# EAGLE design modulo_potencia (EAGLE 5.08)
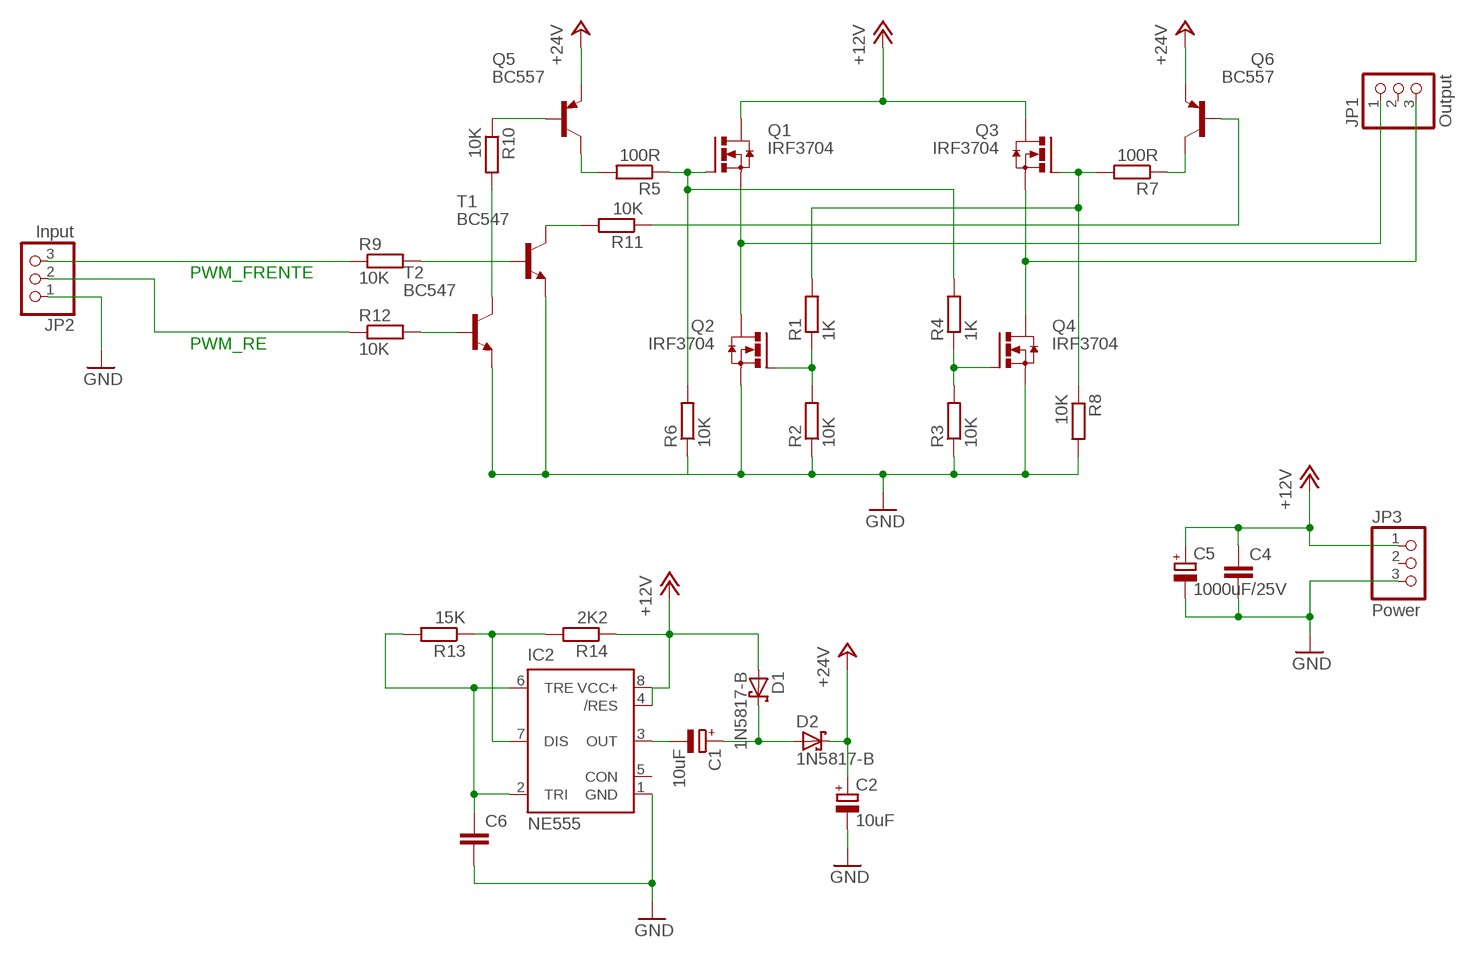
[diagram p0: schematic, sheet 1]

## Parts
C1  10uF  CPOL-EUE2.5-7  [E2,5-7]
C2  10uF  CPOL-EUE2.5-7  [E2,5-7]
C4  C-EU075-032X103  [C075-032X103]
C5  1000uF/25V  CPOL-EUE5-10.5  [E5-10,5]
C6  C-EU075-032X103  [C075-032X103]
D1  1N5817-B  [DO41-7.6]
D2  1N5817-B  [DO41-7.6]
IC2  NE555  [DIL-08]
JP1  Output  PINHD-1X3  [1X03]
JP2  Input  PINHD-1X3  [1X03]
JP3  Power  PINHD-1X3  [1X03]
Q1  IRF3704  [TO220AH]
Q2  IRF3704  [TO220AH]
Q3  IRF3704  [TO220AH]
Q4  IRF3704  [TO220AH]
Q5  BC557  [TO92]
Q6  BC557  [TO92]
R1  1K  R-EU_0207/12  [0207/12]
R2  10K  R-EU_0207/12  [0207/12]
R3  10K  R-EU_0207/12  [0207/12]
R4  1K  R-EU_0207/12  [0207/12]
R5  100R  R-EU_0207/12  [0207/12]
R6  10K  R-EU_0207/12  [0207/12]
R7  100R  R-EU_0207/12  [0207/12]
R8  10K  R-EU_0207/12  [0207/12]
R9  10K  R-EU_0207/12  [0207/12]
R10  10K  R-EU_0207/12  [0207/12]
R11  10K  R-EU_0207/10  [0207/10]
R12  10K  R-EU_0207/12  [0207/12]
R13  15K  R-EU_0204/2V  [0204V]
R14  2K2  R-EU_0204/2V  [0204V]
T1  BC547  [TO92]
T2  BC547  [TO92]

## Nets
+12V [power]: C4.1 C5.+ D1.A IC2.4(/RES) IC2.8(VCC+) JP3.1 Q1.C(D) Q3.C(D) R14.1
+24V: C2.+ D2.C Q5.1(E) Q6.1(E)
GND [power]: C2.- C4.2 C5.- C6.2 IC2.1(GND) JP2.1 JP3.3 Q2.E(S) Q4.E(S) R2.1 R3.1 R6.1 R8.2 T1.1(E) T2.1(E)
N$1 [power]: JP1.3 Q3.E(S) Q4.C(D)
N$2: Q2.B(G) R1.1 R2.2
N$3 [power]: JP1.1 Q1.E(S) Q2.C(D)
N$4: Q5.3(C) R5.2
N$5: Q4.B(G) R3.2 R4.1
N$6: Q1.B(G) R4.2 R5.1 R6.2
N$7: Q3.B(G) R1.2 R7.2 R8.1
N$9: Q6.3(C) R7.1
N$10: Q5.2(B) R10.1
N$11: Q6.2(B) R11.1
N$13: R11.2 T1.3(C)
N$14: R10.2 T2.3(C)
N$15: JP2.3 R9.1
N$16: C1.- IC2.3(OUT)
N$17 [power]: IC2.7(DIS) R13.1 R14.2
N$18: C1.+ D1.C D2.A
N$20: JP2.2 R12.1
N$22 [power]: R12.2 T2.2(B)
N$23 [power]: R9.2 T1.2(B)
N$26 [power]: C6.1 IC2.2(TRI) IC2.6(TRE) R13.2
Unconnected: IC2.5(CON) JP1.2 JP3.2

## Notes on the sheet
- PWM_FRENTE
- PWM_RE

## Library data of the parts
C1 C2 C5 = rcl:CPOL-EU: POLARIZED CAPACITOR, European symbol
C4 C6 = rcl:C-EU: CAPACITOR, European symbol
D1 D2 = diode:1N581*: 1.0A SCHOTTKY BARRIER RECTIFIER Source: http://www.diodes.com/datasheets/ds23001.pdf
IC2 = st-microelectronics:NE555: General purpose bipolar Timer
JP1-JP3 = pinhead:PINHD-1X3: PIN HEADER
Q1-Q4 = transistor-power:IRF3704: SMPS MOSFET HEXFET® Power MOSFET Source: http://www.irf.com/product-info/datasheets/data/irf3704.pdf
Q5 Q6 = transistor-pnp:BC557: PNP Transistor
R1-R14 = rcl:R-EU_: RESISTOR, European symbol
T1 T2 = transistor-neu-to92:BC547: NPN TRANSISTOR

## Net classes
0 default: width 1.016 mm, drill 0.254 mm, clearance 1.27 mm
1 power: width 1.778 mm, drill 0.254 mm, clearance 1.27 mm

## Board
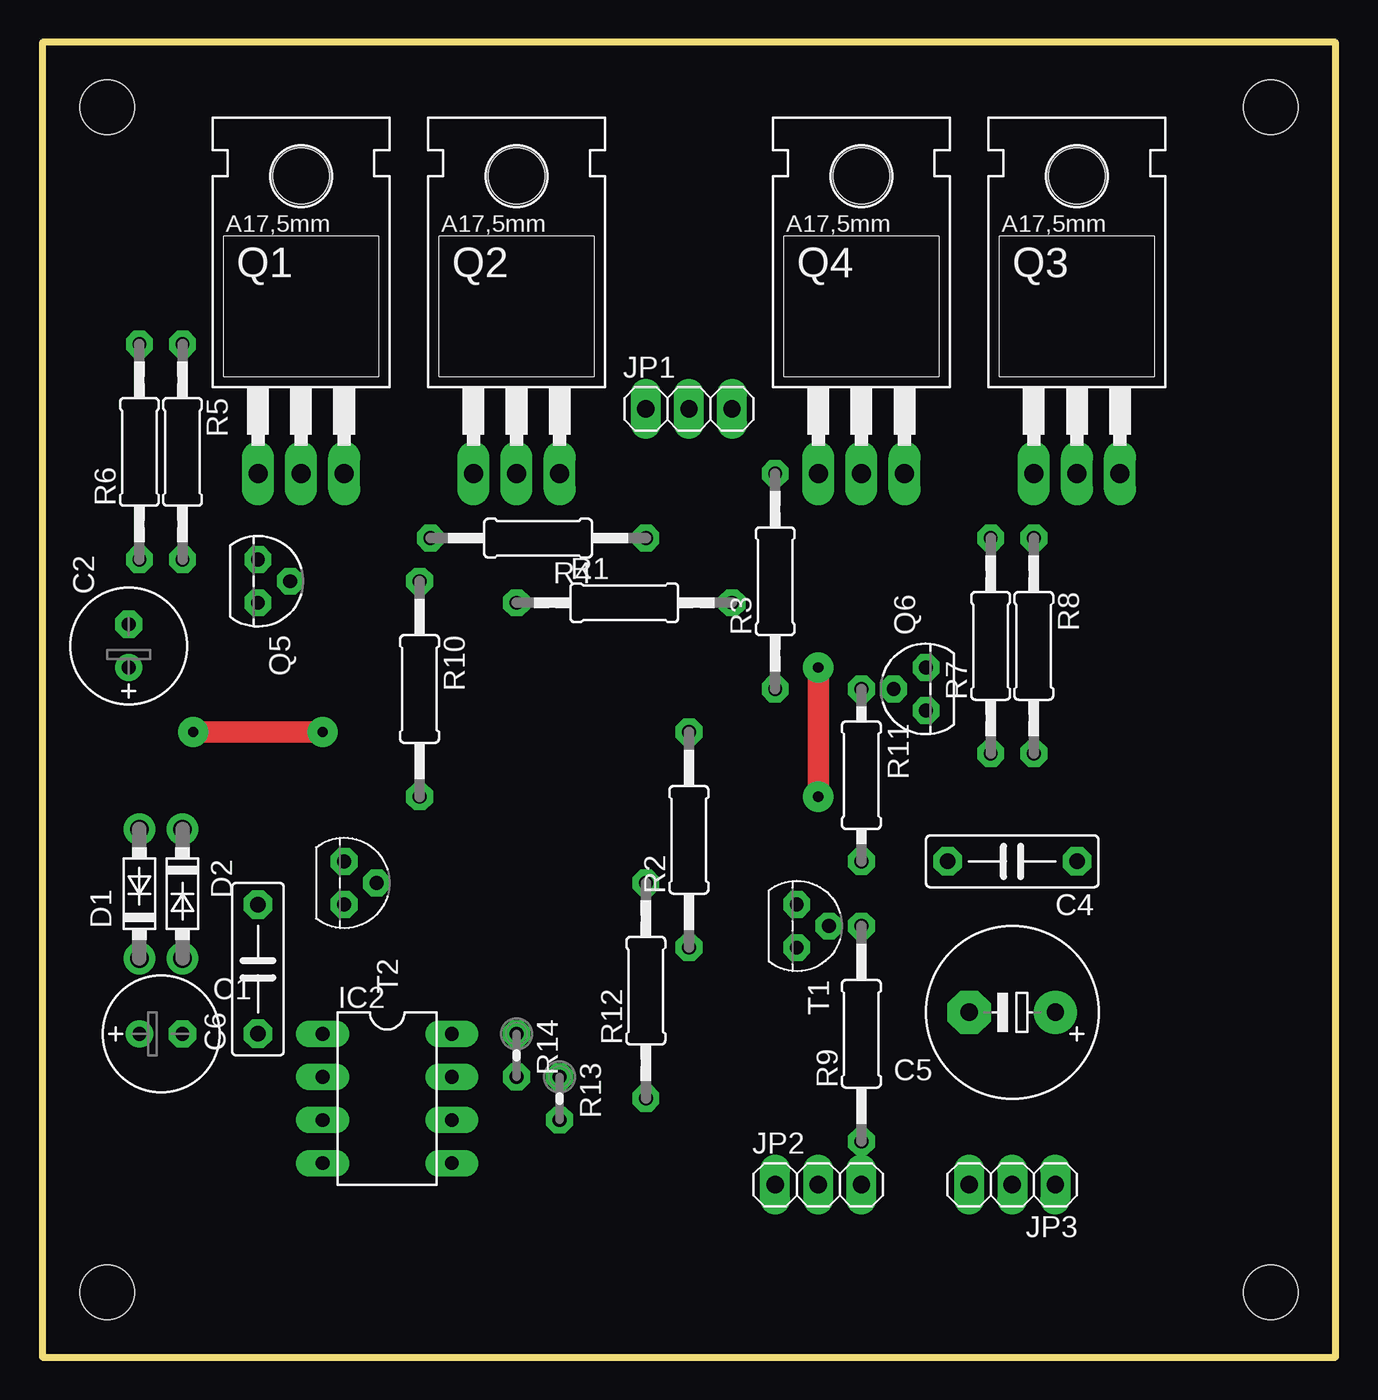
[diagram p1: board, top side]
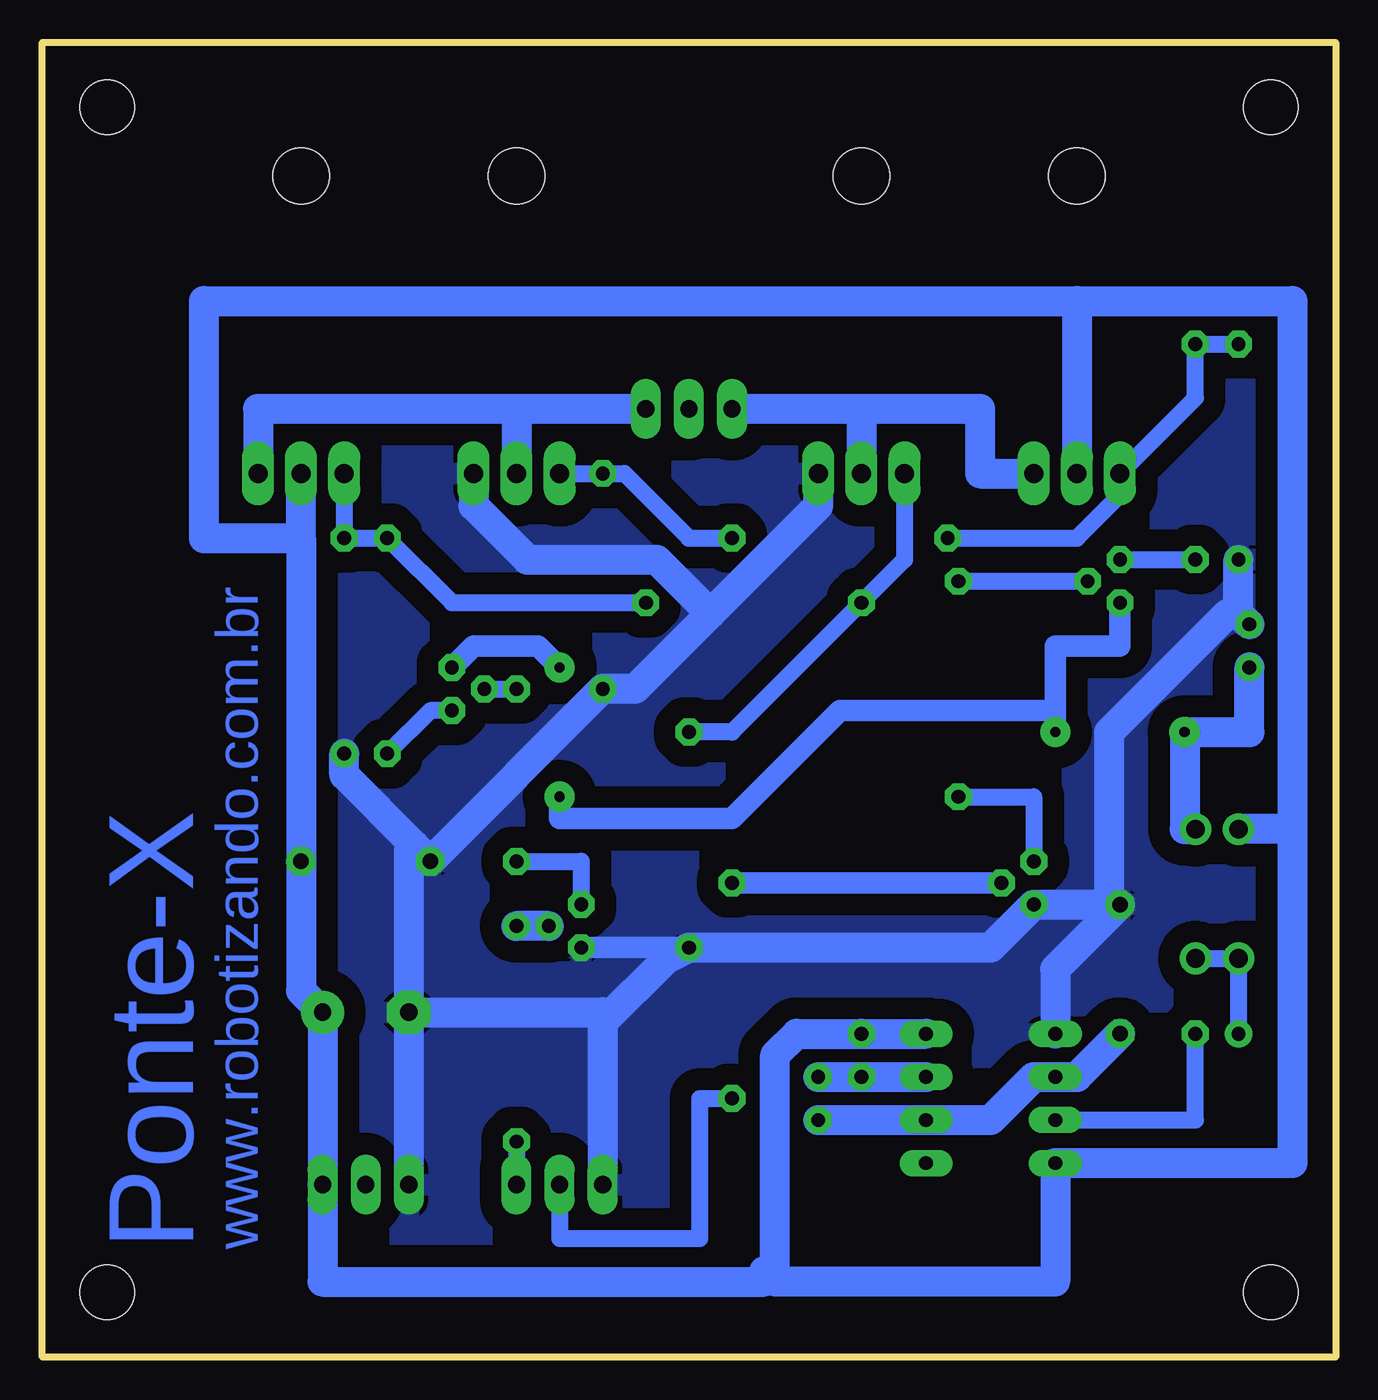
[diagram p2: board, bottom side, seen from below]

Size 76.2 x 77.47 mm. Coordinates in mm from the lower left corner, seen from the top.
Outline: 0,77.47 0,0 76.2,0 76.2,77.47 0,77.47
Copper layers (1*16): Top 0.035mm / dielectric 1.5mm / Bottom 0.035mm
Design rules "default *": minimum track width 10mil, minimum drill 24mil, track to track 8mil, track to pad 8mil, pad to pad 8mil, via to via 8mil, smd to smd 8mil, copper to edge 40mil, drill to drill 8mil, minimum pad ring 15mil, minimum via ring 8mil, stop-mask expansion 4mil, vias tented up to drill 0mil, thermal gap 10mil
Holes 3.2 mm at 3.81,3.81 72.39,3.81 3.81,73.66 72.39,73.66

### Footprints (pad centres in the part's own frame; a part is rotated, then mirrored left to right if it is on the bottom)
E2,5-7 = drill 0.813 pad 1.6 round: + -1.27,0 | drill 0.813 pad 1.6 octagon: - 1.27,0
C075-032X103 = drill 0.914 octagon: 1 -3.81,0; 2 3.81,0
E5-10,5 = drill 1.016 pad 2.54 round: + -2.54,0 | drill 1.016 pad 2.54 octagon: - 2.54,0
DO41-7.6 = drill 1.1 pad 1.7 round: A 3.81,0; C -3.81,0
DIL-08 = drill 0.813 long: 1 -3.81,-3.81; 2 -1.27,-3.81; 3 1.27,-3.81; 4 3.81,-3.81; 5 3.81,3.81; 6 1.27,3.81; 7 -1.27,3.81; 8 -3.81,3.81
1X03 = drill 1.016 long: 1 -2.54,0; 2 0,0; 3 2.54,0
TO220AH = drill 1.118 long: B -2.54,-6.35; C 0,-6.35; E 2.54,-6.35 | hole 3.302: 0,11.176
TO92 = drill 0.813 octagon: 1 1.27,0; 2 0,1.905; 3 -1.27,0
0207/12 = drill 0.813 octagon: 1 -6.35,0; 2 6.35,0
0207/10 = drill 0.813 octagon: 1 -5.08,0; 2 5.08,0
0204V = drill 0.813 octagon: 1 -1.27,0; 2 1.27,0

### Placement (x,y rotation side)
C1  6.98,19.05 0 top
C2  5.08,41.91 90 top
C4  57.15,29.21 180 top
C5  57.15,20.32 180 top
C6  12.7,22.86 90 top
D1  5.71,27.3 90 top
D2  8.25,27.3 270 top
IC2  20.32,15.24 270 top
JP1  38.1,55.88 0 top
JP2  45.72,10.16 0 top
JP3  57.15,10.16 180 top
Q1  15.24,58.42 0 top
Q2  27.94,58.42 0 top
Q3  60.96,58.42 0 top
Q4  48.26,58.42 0 top
Q5  12.7,45.72 270 top
Q6  52.07,39.37 90 top
R1  34.29,44.45 0 top
R2  38.1,30.48 90 top
R3  43.18,45.72 90 top
R4  29.21,48.26 180 top
R5  8.25,53.34 270 top
R6  5.71,53.34 90 top
R7  55.88,41.91 90 top
R8  58.42,41.91 270 top
R9  48.26,19.05 90 top
R10  22.22,39.37 270 top
R11  48.26,34.29 270 top
R12  35.56,21.59 90 top
R13  30.48,15.24 270 top
R14  27.94,17.78 270 top
T1  44.45,25.4 270 top
T2  17.78,27.94 270 top

### Tracks (layer width: path | path; a pad name or v marks a point on that pad's centre or on a via)
+12V
  Bottom 1.778: 60.96,48.26 Q3.C | 60.96,48.26 C4.1 60.96,21.59 C5.+ JP3.1 59.69,4.45 33.65,4.45 33.65,5.08 33.02,4.45 | 33.02,4.45 16.51,4.45 IC2.4 2.54,11.43 2.54,31.11 | 33.02,4.45 33.02,17.78 31.75,19.05 R14.1 IC2.8 | 15.24,62.23 Q1.C | 15.24,62.23 2.54,62.23 2.54,31.11 | 15.24,62.23 66.67,62.23 66.67,48.26 60.96,48.26 | 2.54,31.11 D1.A
+24V  (via drill 0.6 pad 1.78)
  Top 1.27: v16.51,36.83 v8.89,36.83 | v45.72,40.64 v45.72,33.02
  Bottom 1.27: 16.51,38.1 16.51,41.91 12.7,41.91 Q5.1 | 16.51,38.1 v16.51,36.83 | 16.51,38.1 29.21,38.1 35.56,31.75 45.72,31.75 v45.72,33.02 | Q6.1 50.8,41.91 46.99,41.91 v45.72,40.64
  Bottom 1.778: D2.C 8.89,31.11 v8.89,36.83 5.08,36.83 C2.+
GND
  Bottom 1.27: R2.1 T1.1
  Bottom 1.778: C5.- JP3.3 | R8.2 58.42,34.29 54.29,30.16 | 54.29,30.16 C4.2 R3.1 41.27,39.37 36.83,43.81 | Q2.E 30.48,50.16 36.83,43.81 | Q4.E 50.8,50.16 47.62,46.99 40,46.99 36.83,43.81 | C5.- 54.61,29.85 54.29,30.16 | 5.71,43.81 R6.1 | 5.71,43.81 C2.- | IC2.1 16.51,22.86 C6.2 13.33,26.67 | 13.33,26.67 13.33,36.83 6.35,43.81 5.71,43.81 | 43.18,19.69 JP2.1 | 43.18,19.69 39.37,23.5 R2.1 20.32,24.13 T2.1 13.33,26.67 | C5.- 43.18,20.32 43.18,19.69
  pour Bottom: -2.54,78.74 68.58,78.74 68.58,-2.54 -2.54,-2.54
N$1
  Bottom 1.778: 48.26,55.88 JP1.3 | 48.26,55.88 Q4.C | Q3.E 63.5,55.88 48.26,55.88
N$2
  Bottom 1.016: R2.2 35.56,36.83 R1.1 25.4,46.99 Q2.B
N$3
  Bottom 1.778: JP1.1 27.94,55.88 | 27.94,55.88 Q2.C | Q1.E 20.95,52.07 20.95,55.88 27.94,55.88
N$4
  Bottom 1.016: Q5.3 R5.2
N$5
  Bottom 1.016: R4.1 38.1,48.26 41.91,52.07 R3.2 Q4.B
N$6
  Bottom 1.016: R6.2 R5.1 8.25,56.52 Q1.B 12.7,50.8 15.24,48.26 R4.2
N$7
  Bottom 1.016: R1.2 52.07,44.45 R7.2 R8.1 Q3.B
N$9
  Bottom 1.016: Q6.3 53.34,38.1 R7.1
N$10
  Bottom 1.016: R10.1 Q5.2
N$11
  Bottom 1.016: Q6.2 R11.1
N$13
  Bottom 1.016: R11.2 44.45,29.21 T1.3
N$14
  Bottom 1.016: R10.2 17.78,33.02 T2.3
N$15
  Bottom 1.016: R9.1 JP2.3
N$16
  Bottom 1.016: IC2.3 8.25,13.97 C1.-
N$17
  Bottom 1.778: IC2.7 R14.2 R13.1
N$18
  Bottom 1.016: C1.+ D1.C D2.A
N$20
  Bottom 1.016: R12.1 37.46,15.24 37.46,6.98 45.72,6.98 JP2.2
N$22
  Bottom 1.27: R12.2 T2.2
N$23
  Bottom 1.778: T1.2 R9.2
N$26
  Bottom 1.778: R13.2 IC2.6 20.32,13.97 17.78,16.51 IC2.2 15.24,16.51 C6.1

### Text on the board
Bottom: www.robotizando.com.br | Ponte-X